# EAGLE design layer1v1 (EAGLE 7.6.0)
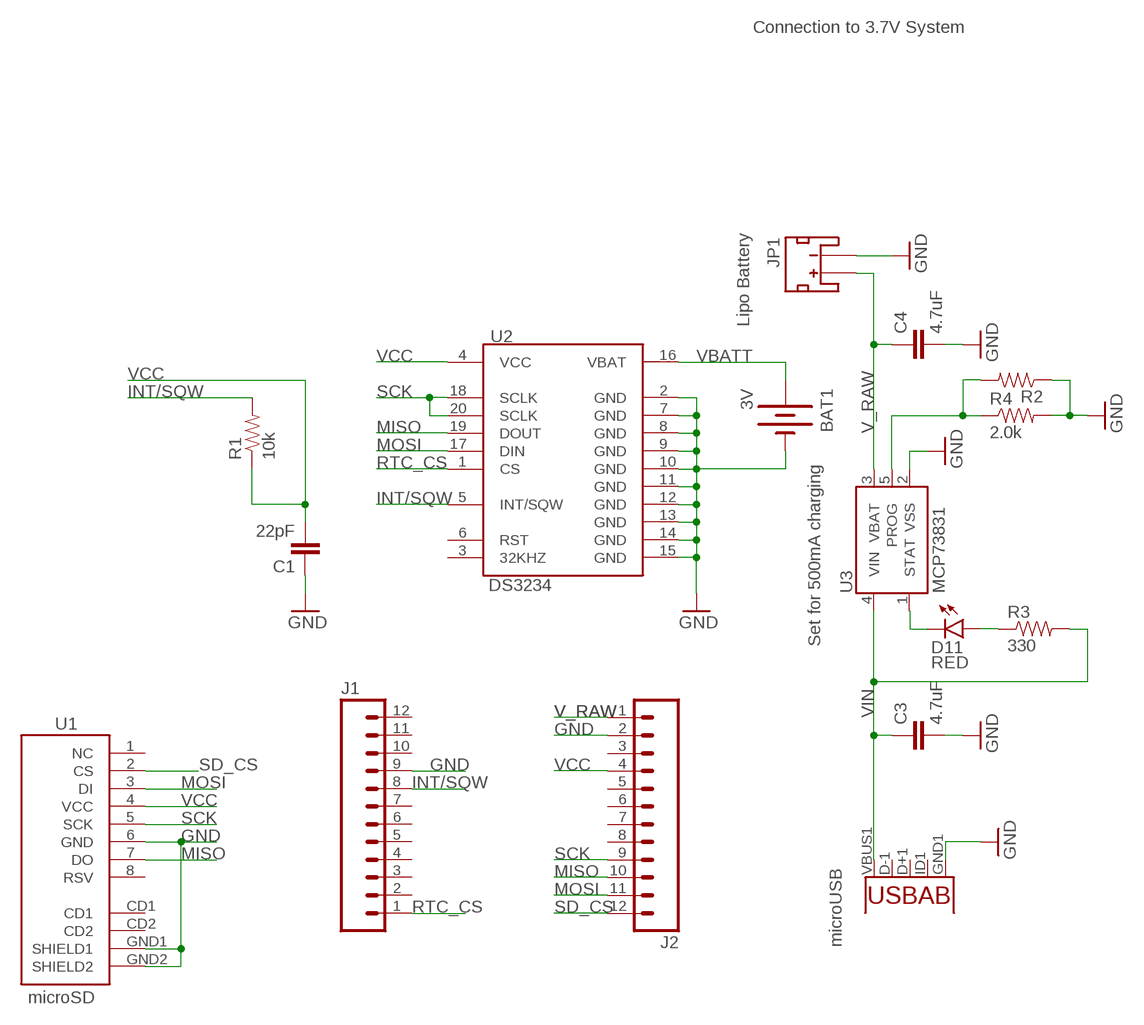
[diagram p0: schematic, sheet 1]

## Parts
BAT1  3V  BATTERY  [BATTCON_12MM_CURVED]
C1  22pF  CAP0402-CAP  [0402-CAP]
C3  4.7uF  4.7UF-6.3V-10%(0603)0603  [0603-CAP]
C4  4.7uF  4.7UF-6.3V-10%(0603)0603  [0603-CAP]
D11  RED  LED-RED0603  [LED-0603]
J1  M12PTH  [1X12]
J2  M12PTH  [1X12]
JP1  JST  JST_2MM_MALE  [JST-2-SMD]
JP9  Micro USB  USB-ABCONN-11794  [USB-AB-MICRO-SMD_V03]
R1  10k  RESISTOR0402-RES  [0402-RES]
R2  RESISTORPTH-1/4W-VERT-KIT  [AXIAL-0.1EZ]
R3  330  330OHM1/10W1%(0603)  [0603-RES]
R4  2.0k  2.0KOHM1/10W5%(0603)  [0603-RES]
U1  microSD  USD-SOCKETSMD  [MICRO-SD-SOCKET-PP]
U2  DS3234  [DS3234]
U3  MCP73831  [SOT23-5]

## Nets
GND: BAT1.GND(-) C1.1 C3.2 C4.2 J1.9 J2.2 JP1.1(-) JP9.GND1(GND) R2.P$1 R4.2 U1.6(GND) U1.GND1(SHIELD1) U1.GND2(SHIELD2) U2.2(GND) U2.7(GND) U2.8(GND) U2.9(GND) U2.10(GND) U2.11(GND) U2.12(GND) U2.13(GND) U2.14(GND) U2.15(GND) U3.2(VSS)
INT/SQW: J1.8 R1.2 U2.5(INT/SQW)
MISO: J2.10 U1.7(DO) U2.19(DOUT)
MOSI: J2.11 U1.3(DI) U2.17(DIN)
N$3: D11.A R3.1
PROG: R2.P$2 R4.1 U3.5(PROG)
RTC_CS: J1.1 U2.1(CS)
SCK: J2.9 U1.5(SCK) U2.18(SCLK) U2.20(SCLK)
SD_CS: J2.12 U1.2(CS)
STAT: D11.C U3.1(STAT)
V_RAW: C4.1 J2.1 JP1.2(+) U3.3(VBAT)
VBATT: BAT1.PWR@1(+) U2.16(VBAT)
VCC: C1.2 J2.4 R1.1 U1.4(VCC) U2.4(VCC)
VIN: C3.1 JP9.VBUS1(VBUS) R3.2 U3.4(VIN)
Unconnected: J1.2 J1.3 J1.4 J1.5 J1.6 J1.7 J1.10 J1.11 J1.12 J2.3 J2.5 J2.6 J2.7 J2.8 JP1.NC1(PAD1) JP1.NC2(PAD2) JP9.D+1(D+) JP9.D-1(D-) JP9.ID1(USBID) U1.1(NC) U1.8(RSV) U1.CD1 U1.CD2 U2.3(32KHZ) U2.6(RST)

## Notes on the sheet
- Connection to 3.7V System
- Lipo Battery
- Set for 500mA charging
- microUSB

## Library data of the parts
BAT1 = SparkFun:BATTERY: Battery Holders Various common sizes : AA, AAA, 20mm coin cell and 12mm coin cell.
C1 = SparkFun:CAP: Capacitor Standard 0603 ceramic capacitor, and 0.1" leaded capacitor.
C3 C4 = SparkFun-Capacitors:4.7UF-6.3V-10%(0603): CAP-08280; PROD_ID: CAP-08280
D11 = SparkFun-LED:LED-RED: Assorted Red LEDs LilyPad 1206- DIO-09912 1206- DIO-00809 0603- DIO-00819; PROD_ID: DIO-00819
J1 J2 = SparkFun-Connectors:M12: Header 12 Standard 12-pin 0.1" header. Use with straight break away headers (SKU : PRT-00116), right angle break away headers (PRT-00553), swiss pins (PRT-00743), machine pins (PRT-00117), and female headers (PRT-00115).
JP1 = SparkFun-Connectors:JST_2MM_MALE: Mates to single-cell LiPo batteries. CONN-08352; PROD_ID: CONN-08352
JP9 = SparkFun-Connectors:USB-AB: This is a USB AB connector that is compatible with USB OTG. i.e. this connector can serve as a host or device; PROD_ID: CONN-11794
R1 = SparkFun:RESISTOR: Resistor Basic schematic elements and footprints for 0603, 1206, and PTH resistors.
R2 = SparkFun-Resistors:RESISTOR: Resistor Basic schematic elements and footprints for 0603, 1206, and PTH resistors.
R3 = SparkFun-Resistors:330OHM1/10W1%(0603): RES-00818; PROD_ID: RES-00818
R4 = SparkFun-Resistors:2.0KOHM1/10W5%(0603): RES-08296; PROD_ID: RES-08296
U1 = SparkFun:USD-SOCKET: microSD Socket Push-push type uSD socket. Schematic element and footprint production proven. Spark Fun Electronics SKU : PRT-00127. tDoc lines correctly indicate media card edge positions when inserting (unlocked, locked, depressed).
U2 = SparkFun:DS3234: DS3234 Real Time Clock
U3 = SparkFun-PowerIC:MCP73831: Miniature single cell, fully integrated Li-Ion, Li-polymer charge management controller http://ww1.microchip.com/downloads/en/DeviceDoc/21984a.pdf IC-09995; PROD_ID: IC-09995

## Board
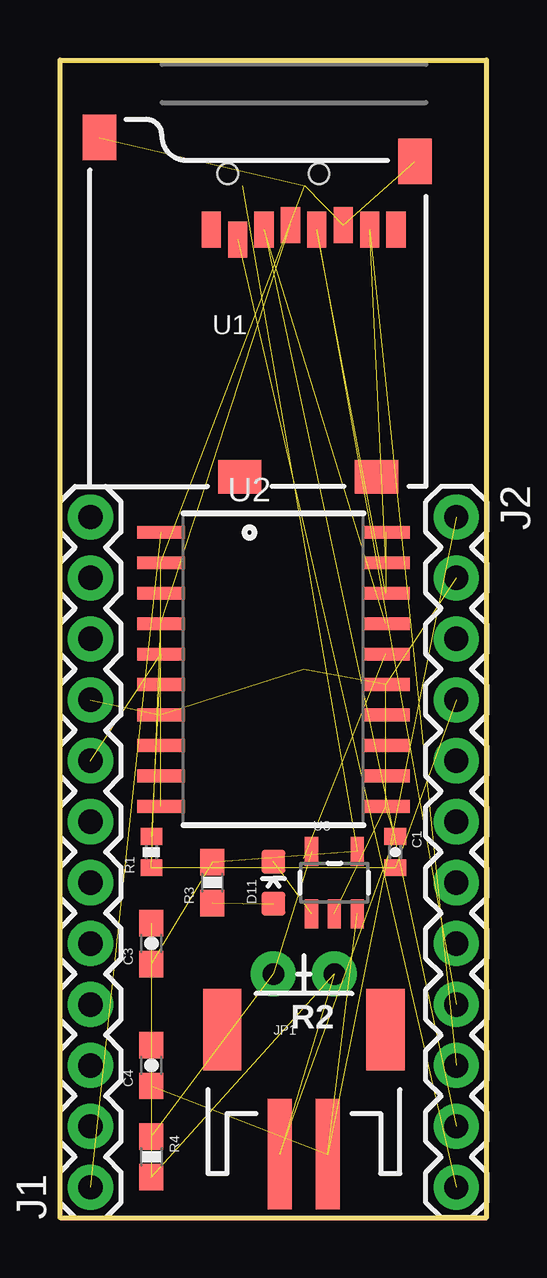
[diagram p1: board, top side]
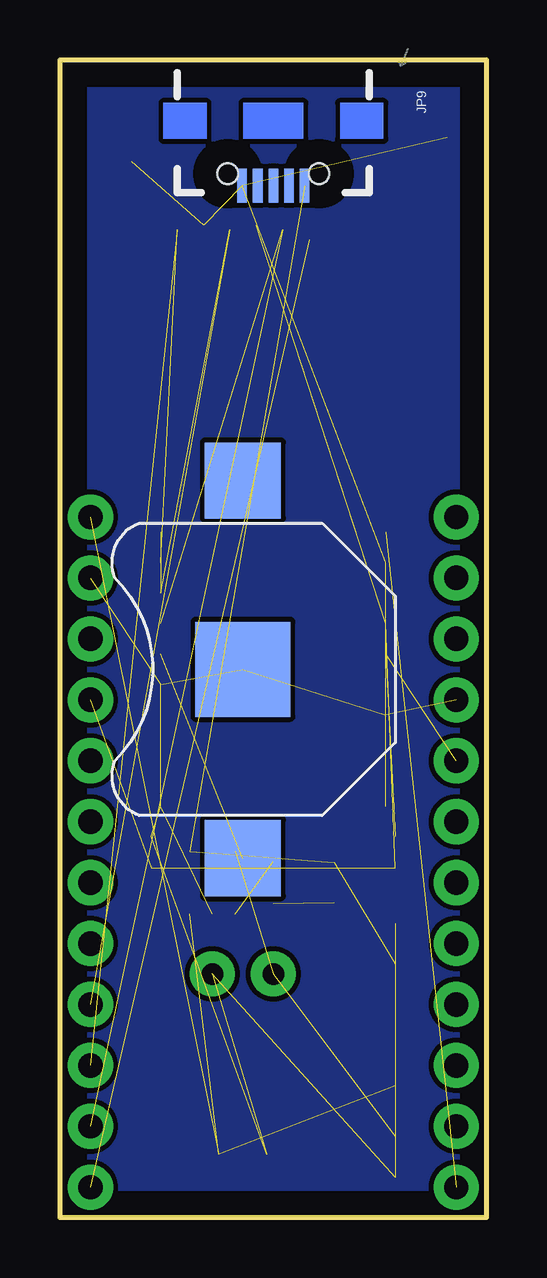
[diagram p2: board, bottom side, seen from below]

Size 17.78 x 48.26 mm. Coordinates in mm from the lower left corner, seen from the top.
Outline: 0,0 0,48.26 17.78,48.26 17.78,0 0,0
Copper layers (1*16): Top 0.035mm / dielectric 1.5mm / Bottom 0.035mm
Design rules "default": minimum track width 10mil, minimum drill 24mil, track to track 8mil, track to pad 8mil, pad to pad 8mil, via to via 8mil, smd to smd 8mil, copper to edge 40mil, drill to drill 8mil, minimum pad ring 10mil, minimum via ring 8mil, stop-mask expansion 4mil, vias tented up to drill 0mil, thermal gap 10mil

### Footprints (pad centres in the part's own frame; a part is rotated, then mirrored left to right if it is on the bottom)
BATTCON_12MM_CURVED = smd 3.962 x 3.962: GND 0,0 | smd 3.175 x 3.175: PWR@1 -7.874,0; PWR@2 7.874,0
0402-CAP = smd 0.7 x 0.9: 1 -0.65,0; 2 0.65,0
0603-CAP = smd 1.1 x 1: 1 -0.85,0; 2 0.85,0
LED-0603 = smd 1 x 1: A 0,-0.877; C 0,0.877
1X12 = drill 1.016 pad 1.88: 1 0,0; 2 2.54,0; 3 5.08,0; 4 7.62,0; 5 10.16,0; 6 12.7,0; 7 15.24,0; 8 17.78,0; 9 20.32,0; 10 22.86,0; 11 25.4,0; 12 27.94,0
JST-2-SMD = smd 1 x 4.6: 1 -1,-3.7; 2 1,-3.7 | smd 1.6 x 3.4: NC1 -3.4,1.5; NC2 3.4,1.5
USB-AB-MICRO-SMD_V03 = smd 1.4 x 0.4: D+1 2.7,0; D-1 2.7,0.65; GND1 2.7,-1.3; ID1 2.7,-0.65; VBUS1 2.7,1.3 | hole 0.85: 2.2,1.9; 2.2,-1.9
0402-RES = smd 0.7 x 0.9: 1 -0.65,0; 2 0.65,0
AXIAL-0.1EZ = drill 0.9 pad 1.88: P$1 0,0; P$2 2.54,0
0603-RES = smd 1.1 x 1: 1 -0.85,0; 2 0.85,0
MICRO-SD-SOCKET-PP = smd 0.8 x 1.5: 1 -8.94,10.7; 2 -7.84,10.3; 3 -6.74,10.7; 4 -5.64,10.9; 5 -4.54,10.7; 6 -3.44,10.9; 7 -2.34,10.7; 8 -1.24,10.7 | smd 1.8 x 1.4: CD1 -7.75,0.4; CD2 -2.05,0.4 | smd 1.4 x 1.9: GND1 -13.6,14.55; GND2 -0.45,13.55
DS3234 = smd 0.53 x 1.98: 1 -5.715,-4.685; 2 -4.445,-4.685; 3 -3.175,-4.685; 4 -1.905,-4.685; 5 -0.635,-4.685; 6 0.635,-4.685; 7 1.905,-4.685; 8 3.175,-4.685; 9 4.445,-4.685; 10 5.715,-4.685; 11 5.715,4.685; 12 4.445,4.685; 13 3.175,4.685; 14 1.905,4.685; 15 0.635,4.685; 16 -0.635,4.685; 17 -1.905,4.685; 18 -3.175,4.685; 19 -4.445,4.685; 20 -5.715,4.685
SOT23-5 = smd 0.55 x 1.2: 1 -0.95,-1.3; 2 0,-1.3; 3 0.95,-1.3; 4 0.95,1.3; 5 -0.95,1.3

### Placement (x,y rotation side)
BAT1  10.16,22.86 90 bottom
C1  13.97,15.24 270 top
C3  3.81,11.43 90 top
C4  3.81,6.35 90 top
D11  8.89,13.97 0 top
J1  1.27,1.27 90 top
J2  16.51,29.21 270 top
JP1  10.16,6.35 0 top
JP9  8.89,45.72 270 bottom
R1  3.81,15.24 90 top
R2  11.43,10.16 180 top
R3  6.35,13.97 90 top
R4  3.81,2.54 270 top
U1  15.24,30.48 0 top
U2  8.89,22.86 270 top
U3  11.43,13.97 0 top

### Tracks (layer width: path | path; a pad name or v marks a point on that pad's centre or on a via)
GND  (23 unrouted)
INT/SQW  (2 unrouted)
MISO  (2 unrouted)
MOSI  (2 unrouted)
N$1
  pour Bottom: 0,48.26 17.78,48.26 17.78,0 0,0
N$3  (1 unrouted)
PROG  (2 unrouted)
RTC_CS  (1 unrouted)
SCK  (3 unrouted)
SD_CS  (1 unrouted)
STAT  (1 unrouted)
V_RAW  (3 unrouted)
VBATT  (1 unrouted)
VCC  (4 unrouted)
VIN  (3 unrouted)